# Altium schematic sheet 3轴5.2-原理图-V3.2.SchDoc
size A2
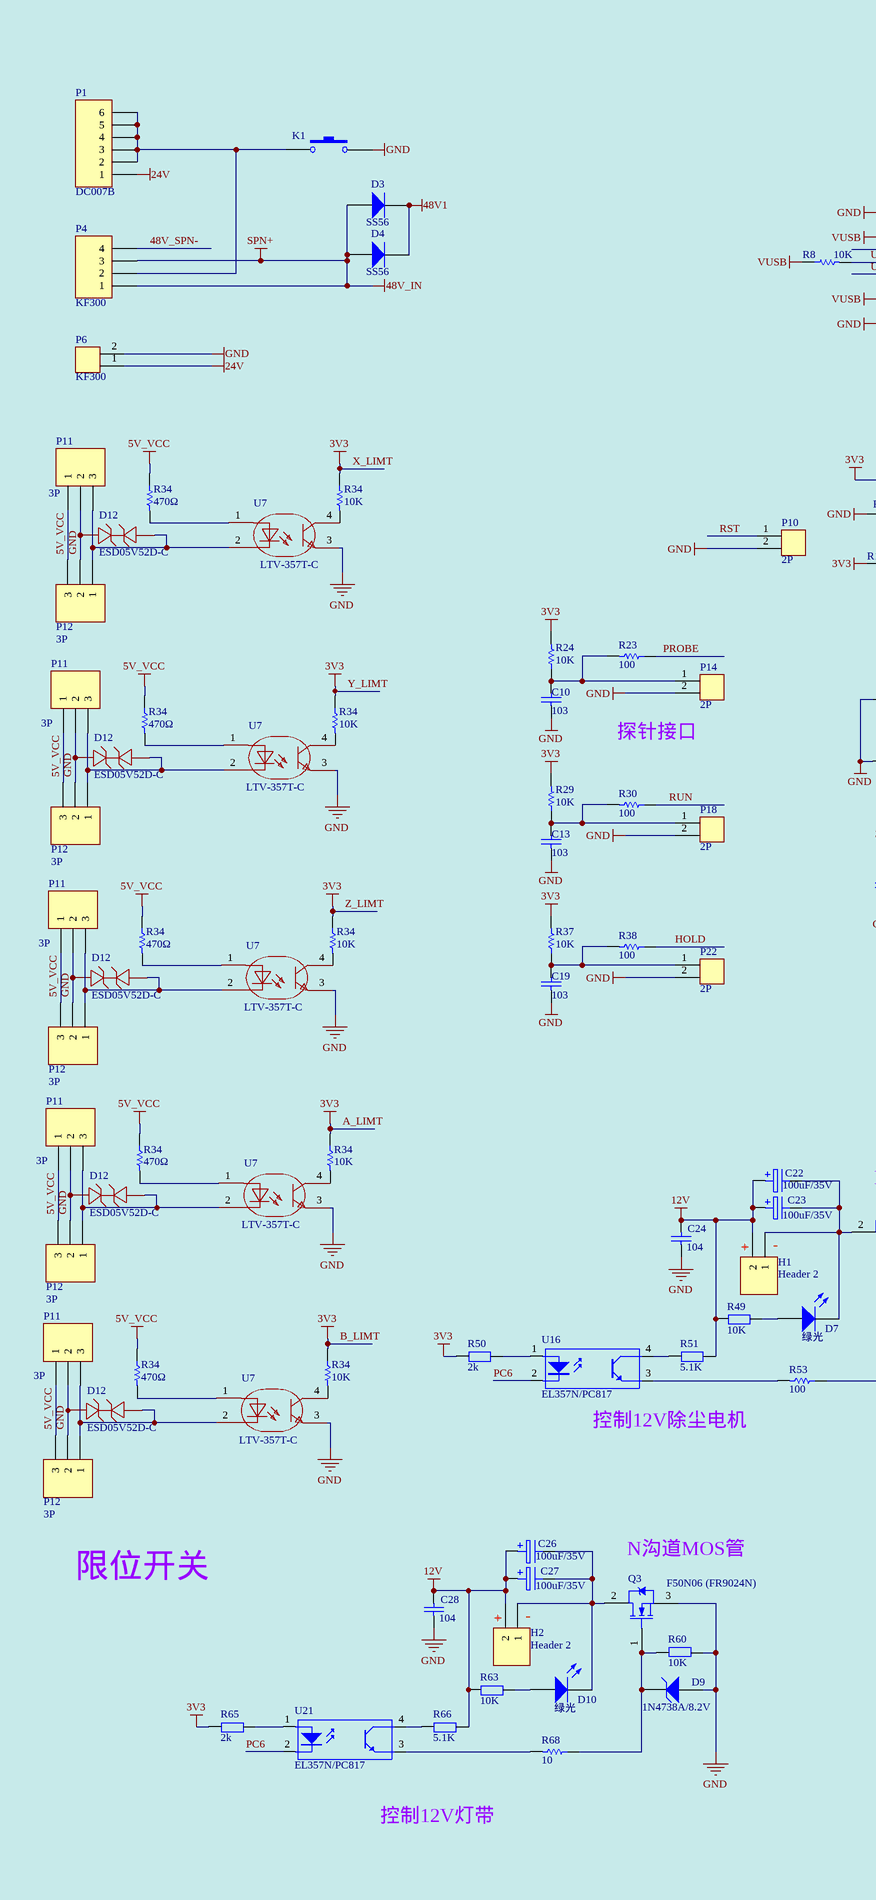
[diagram p0: 3轴5.2-原理图-V3.2.SchDoc, left]
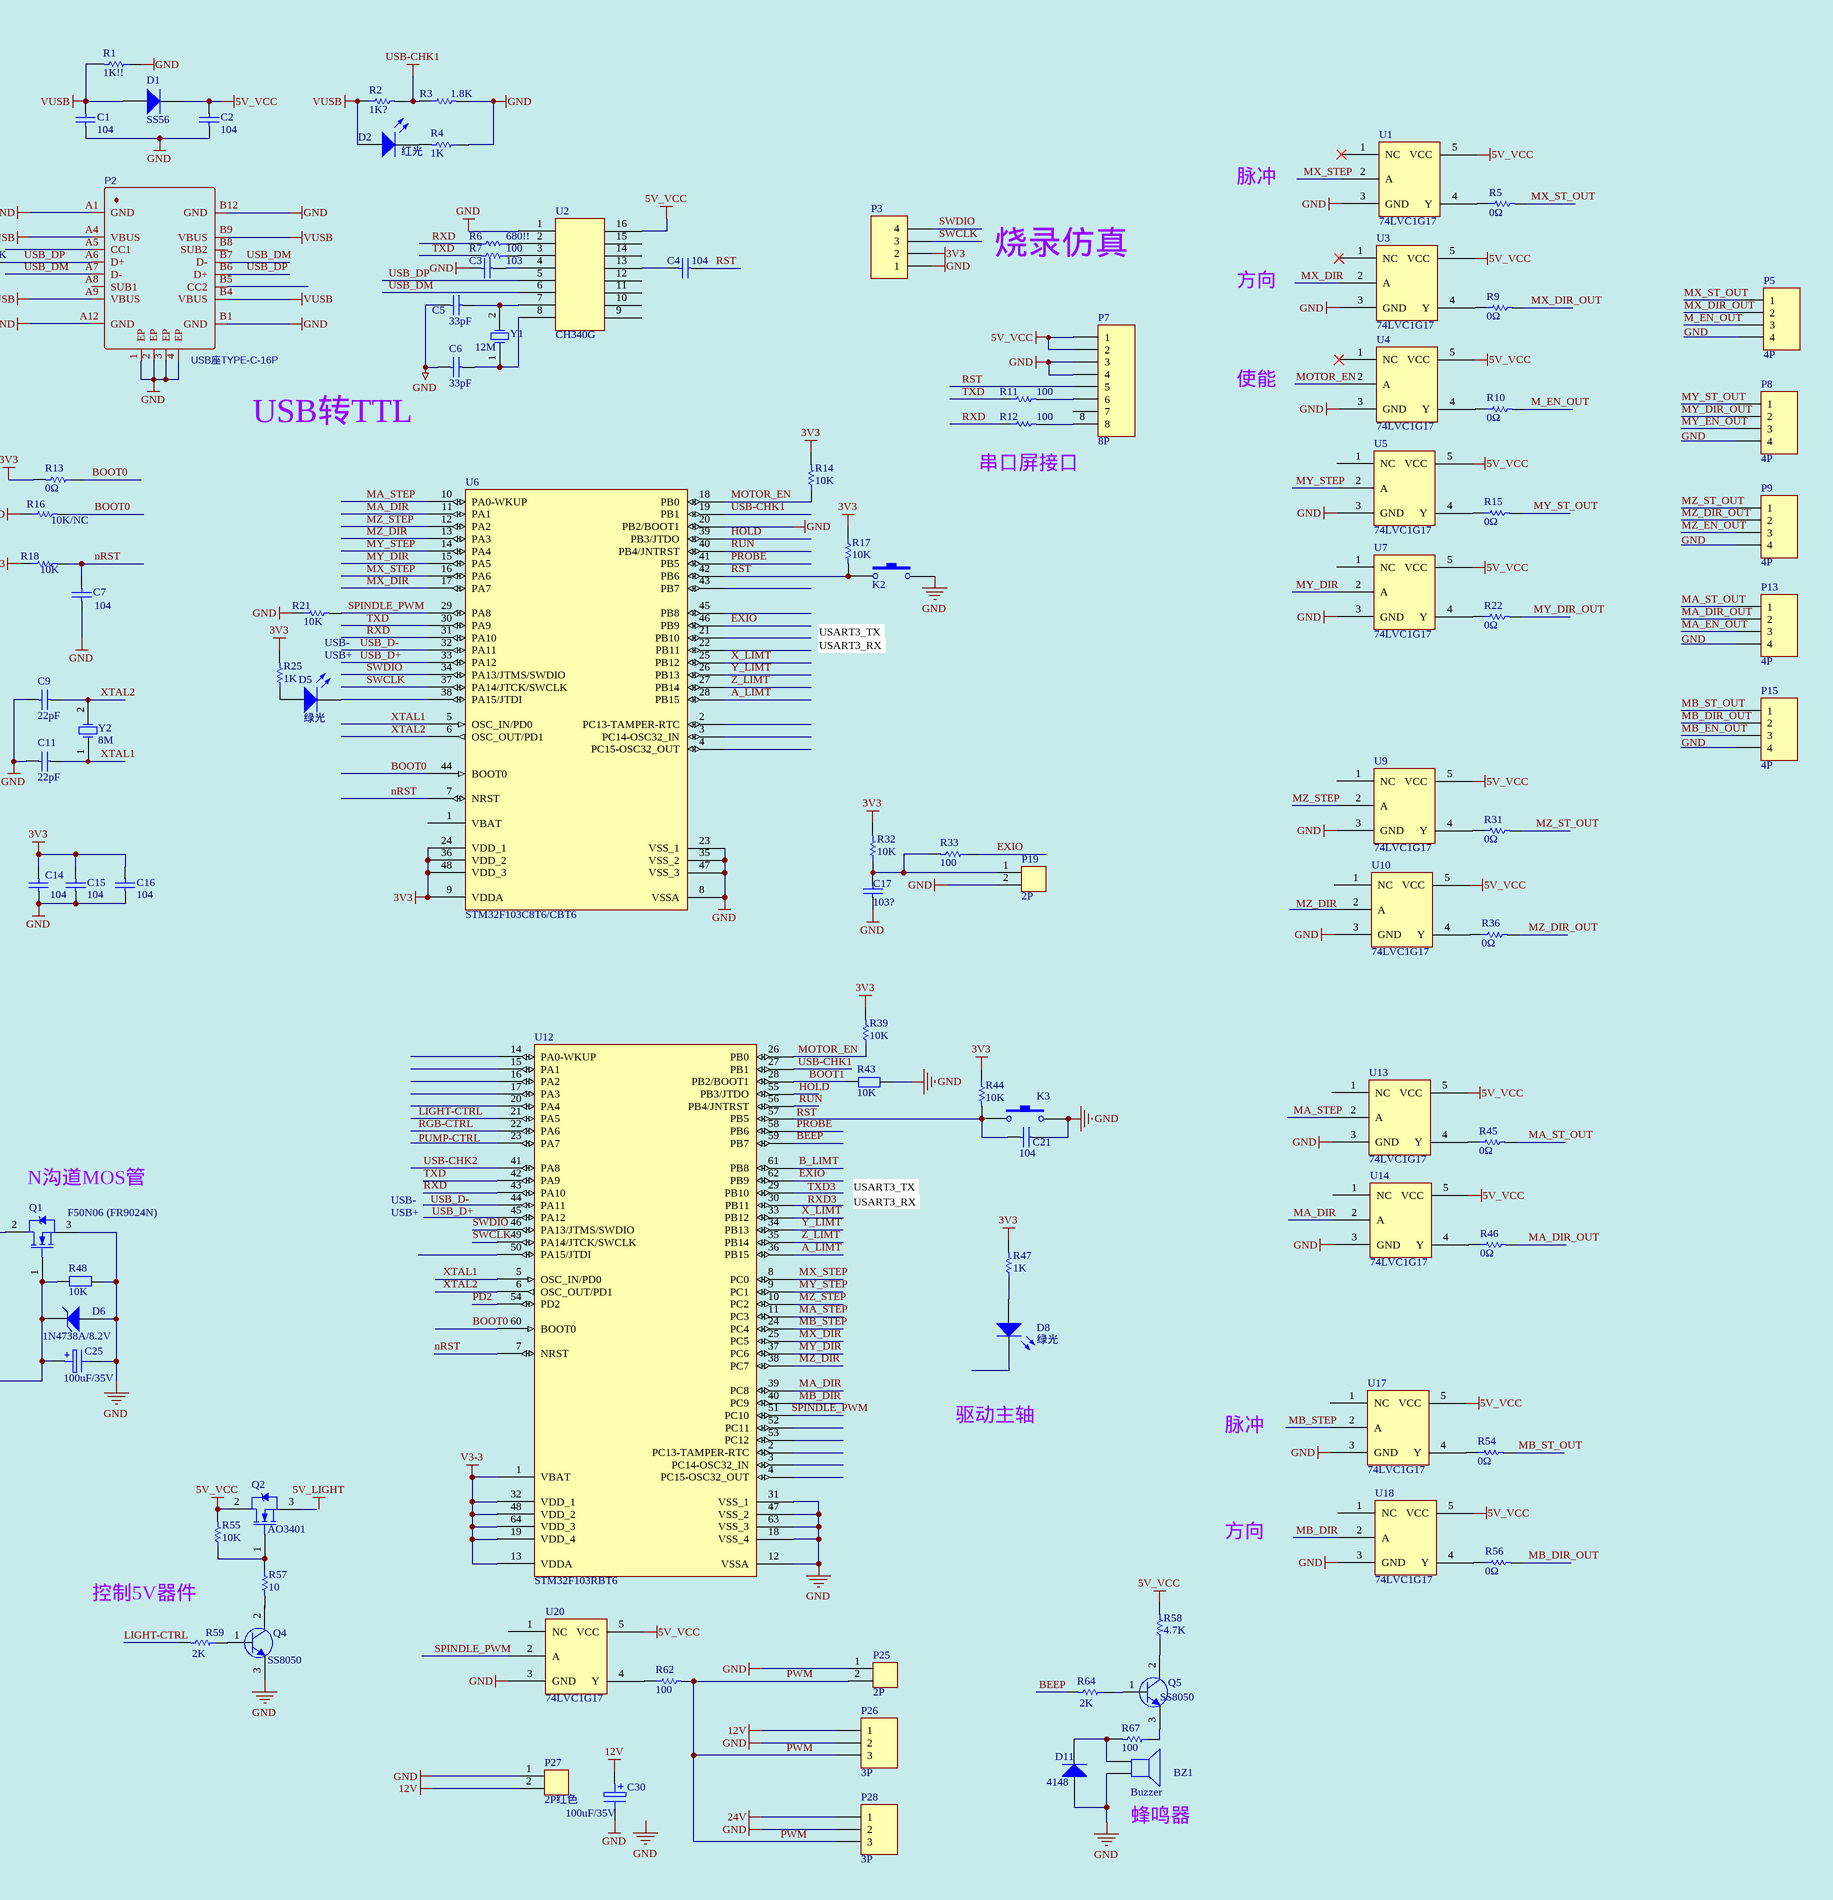
[diagram p1: 3轴5.2-原理图-V3.2.SchDoc, right]

## Parts
(Parts that share a designator on the sheet are numbered #1, #2 ... from top to bottom, then left to right.)
BZ1  Buzzer  [PIN2]
C1  104  [0603C]
C2  104  [0603C]
C3  103  [0603C]
C4  104  [0603C]
C5  33pF  [0603C]
C6  33pF  [0603C]
C7  104  [0603C]
C9  22pF  [0603C]
C10  103  [0603C]
C11  22pF  [0603C]
C13  103  [0603C]
C14  104  [0603C]
C15  104  [0603C]
C16  104  [0603C]
C17  103?  [0603C]
C19  103  [0603C]
C21  104  [0603C]
C22  100uF/35V  [电解电容贴片6x6]
C23  100uF/35V  [电解电容贴片6x6]
C24  104  [0603C]
C25  100uF/35V  [电解电容贴片6x6]
C26  100uF/35V  [电解电容贴片6x6]
C27  100uF/35V  [电解电容贴片6x6]
C28  104  [0603C]
C30  100uF/35V  [电解电容贴片6x6]
D1  SS56  [SMA]
D2  红光  [0603LED]
D3  SS56  [SMA]
D4  SS56  [SMA]
D5  绿光  [0603LED]
D6  1N4738A/8.2V  [DIODE-0.4]
D7  绿光  [0603LED]
D8  绿光  [0603LED]
D9  1N4738A/8.2V  [DIODE-0.4]
D10  绿光  [0603LED]
D11  4148  [SMA]
D12#1  ESD05V52D-C  [SOD-523_L1.2-W0.8-LS1.6-BI]
D12#2  ESD05V52D-C  [SOD-523_L1.2-W0.8-LS1.6-BI]
D12#3  ESD05V52D-C  [SOD-523_L1.2-W0.8-LS1.6-BI]
D12#4  ESD05V52D-C  [SOD-523_L1.2-W0.8-LS1.6-BI]
D12#5  ESD05V52D-C  [SOD-523_L1.2-W0.8-LS1.6-BI]
H1  Header 2  [JK128-500-2P]
H2  Header 2  [JK128-500-2P]
K1  开关按键  [船型开关KCD1-101]  (value not drawn)
K2  按键  [按键6x6贴片]  (value not drawn)
K3  按键  [按键6x6贴片]  (value not drawn)
P1  DC007B  [DC007B]
P2  USB座TYPE-C-16P  [USB-TYPE-C-16P]
P3  (no value)  [SIP4]
P4  KF300  [直插座4P-KF300]
P5  4P  [HDR1X4_CON]
P6  KF300  [直插座2P-KF300]
P7  8P  [IDC8]
P8  4P  [HDR1X4_CON]
P9  4P  [HDR1X4_CON]
P10  2P  [HDR1X2_CON]
P11#1  3P  [HDR1X3_CON]
P11#2  3P  [HDR1X3_CON]
P11#3  3P  [HDR1X3_CON]
P11#4  3P  [HDR1X3_CON]
P11#5  3P  [HDR1X3_CON]
P12#1  3P  [HDR1X3_CON]
P12#2  3P  [HDR1X3_CON]
P12#3  3P  [HDR1X3_CON]
P12#4  3P  [HDR1X3_CON]
P12#5  3P  [HDR1X3_CON]
P13  4P  [HDR1X4_CON]
P14  2P  [HDR1X2_CON]
P15  4P  [HDR1X4_CON]
P18  2P  [HDR1X2_CON]
P19  2P  [HDR1X2_CON]
P22  2P  [HDR1X2_CON]
P25  2P  [HDR1X2_CON]
P26  3P  [HDR1X3_CON]
P27  2P红色  [HDR1X2_CON]
P28  3P  [HDR1X3_CON]
Q1  F50N06 (FR9024N)  [TO-252]
Q2  AO3401  [SOT-23]
Q3  F50N06 (FR9024N)  [TO-252]
Q4  SS8050  [SOT-23]
Q5  SS8050  [SOT-23]
R1  1K!!  [0603R]
R2  1K?  [0603R]
R3  1.8K  [0603R]
R4  1K  [0603R]
R5  0Ω  [0603R]
R6  680!!  [0603R]
R7  100  [0603R]
R8  10K  [0603R]
R9  0Ω  [0603R]
R10  0Ω  [0603R]
R11  100  [0603R]
R12  100  [0603R]
R13  value 0Ω  [0603R]  (hidden comment: 10k)
R14  value 10K  [0603R]
R15  0Ω  [0603R]
R16  value 10K/NC  [0603R]  (hidden comment: 10k)
R17  10K  [0603R]
R18  10k  [0603R]
R21  10K  [0603R]
R22  0Ω  [0603R]
R23  100  [0603R]
R24  10K  [0603R]
R25  1K  [0603R]
R29  10K  [0603R]
R30  100  [0603R]
R31  0Ω  [0603R]
R32  10K  [0603R]
R33  100  [0603R]
R34#1  470Ω  [0603R]
R34#2  10K  [0603R]
R34#3  470Ω  [0603R]
R34#4  10K  [0603R]
R34#5  470Ω  [0603R]
R34#6  10K  [0603R]
R34#7  470Ω  [0603R]
R34#8  10K  [0603R]
R34#9  470Ω  [0603R]
R34#10  10K  [0603R]
R36  0Ω  [0603R]
R37  10K  [0603R]
R38  100  [0603R]
R39  value 10K  [0603R]
R43  10K  [0805R]
R44  10K  [0603R]
R45  0Ω  [0603R]
R46  0Ω  [0603R]
R47  1K  [0603R]
R48  10K  [0603R]
R49  10K  [0603R]
R50  2k  [0603R]
R51  5.1K  [0603R]
R53  100  [0603R]
R54  0Ω  [0603R]
R55  10K  [0603R]
R56  0Ω  [0603R]
R57  10  [0603R]
R58  4.7K  [0603R]
R59  2K  [0603R]
R60  10K  [0603R]
R62  100  [0603R]
R63  10K  [0603R]
R64  2K  [0603R]
R65  2k  [0603R]
R66  5.1K  [0603R]
R67  100  [0603R]
R68  10  [0603R]
U1  74LVC1G17  [SOT-23-5]
U2  CH340G  [SOP16]
U3  74LVC1G17  [SOT-23-5]
U4  74LVC1G17  [SOT-23-5]
U5  74LVC1G17  [SOT-23-5]
U6  STM32F103C8T6/CBT6  [LQFP48]
U7#1  LTV-357T-C  [SOP-4_L4.4-W3.9-P2.54-LS7.0-TL]
U7#2  74LVC1G17  [SOT-23-5]
U7#3  LTV-357T-C  [SOP-4_L4.4-W3.9-P2.54-LS7.0-TL]
U7#4  LTV-357T-C  [SOP-4_L4.4-W3.9-P2.54-LS7.0-TL]
U7#5  LTV-357T-C  [SOP-4_L4.4-W3.9-P2.54-LS7.0-TL]
U7#6  LTV-357T-C  [SOP-4_L4.4-W3.9-P2.54-LS7.0-TL]
U9  74LVC1G17  [SOT-23-5]
U10  74LVC1G17  [SOT-23-5]
U12  STM32F103RBT6  [LQFP-64]
U13  74LVC1G17  [SOT-23-5]
U14  74LVC1G17  [SOT-23-5]
U16  EL357N/PC817  [SOP-4M]
U17  74LVC1G17  [SOT-23-5]
U18  74LVC1G17  [SOT-23-5]
U20  74LVC1G17  [SOT-23-5]
U21  EL357N/PC817  [SOP-4M]
Y1  12M  [晶振贴片49SSMD]
Y2  8M  [晶振贴片]

## Nets
5V_VCC: C2.2 D1.2 P7.1 P7.2 P11#1.1 P11#2.1 P11#3.1 P11#4.1 P11#5.1 P12#1.3 P12#2.3 P12#3.3 P12#4.3 P12#5.3 Q2.2(D) R34#1.1 R34#3.1 R34#5.1 R34#7.1 R34#9.1 R55.2 U1.5(VCC) U2.16 U3.5(VCC) U4.5(VCC) U5.5(VCC) U7#2.5(VCC) U9.5(VCC) U10.5(VCC) U13.5(VCC) U14.5(VCC) U17.5(VCC) U18.5(VCC) U20.5(VCC)
12V: C22.1 C23.1 C24.2 C26.1 C27.1 C28.2 C30.1 H1.2 H2.2 P26.1 P27.2 R49.1 R51.2 R63.1 R66.2
24V: P1.1 P6.1 P28.1
48V1: D3.2 D4.2
48V_IN: D3.1 D4.1 P4.1 P4.3  [also labelled SPN+]
A_LIMT: C14.2 C15.2 C16.2 P3.2 R13.2 R14.2 R17.1 R18.1 R24.2 R25.2 R29.2 R32.2 R34#2.1 R34#4.1 R34#6.1 R34#8.1 R34#10.1 R37.2 R39.2 R44.1 R47.2 R50.1 R65.1 U6.9(VDDA) U6.24(VDD_1) U6.25(PB12) U6.26(PB13) U6.27(PB14) U6.28(PB15) U6.36(VDD_2) U6.48(VDD_3) U12.33(PB12) U12.34(PB13) U12.35(PB14) U12.36(PB15) U12.61(PB8)  [also labelled 3V3, B_LIMT, X_LIMT, Y_LIMT, Z_LIMT]
GND: BZ1.2 C1.1 C2.1 C3.2 C5.2 C6.2 C7.1 C9.2 C10.1 C11.2 C13.1 C14.1 C15.1 C16.1 C17.1 C19.1 C21.1 C24.1 C25.2 C28.1 C30.2 D6.1(A) D9.1(A) D11.1 D12#1.1 D12#2.1 D12#3.1 D12#4.1 D12#5.1 K1.2 K2.2 K3.2 P2.1(EP) P2.2(EP) P2.3(EP) P2.4(EP) P2.A1(GND) P2.A12(GND) P2.B1(GND) P2.B12(GND) P3.1 P6.2 P7.3 P7.4 P10.2 P11#1.2 P11#2.2 P11#3.2 P11#4.2 P11#5.2 P12#1.2 P12#2.2 P12#3.2 P12#4.2 P12#5.2 P14.2 P18.2 P19.2 P22.2 P25.1 P26.2 P27.1 P28.2 Q1.3(S) Q3.3(S) Q4.3(E) R1.1 R3.2 R4.1 R16.1 R21.1 R43.2 R48.1 R60.1 U1.3(GND) U2.1 U3.3(GND) U4.3(GND) U5.3(GND) U6.8(VSSA) U6.20(PB2/BOOT1) U6.23(VSS_1) U6.35(VSS_2) U6.47(VSS_3) U7#1.3 U7#2.3(GND) U7#3.3 U7#4.3 U7#5.3 U7#6.3 U9.3(GND) U10.3(GND) U12.12(VSSA) U12.18(VSS_4) U12.31(VSS_1) U12.47(VSS_2) U12.63(VSS_3) U13.3(GND) U14.3(GND) U17.3(GND) U18.3(GND) U20.3(GND)
USB-CHK1: R2.2 R3.1 U6.19(PB1) U12.27(PB1)
V3-3: U12.1(VBAT) U12.13(VDDA) U12.19(VDD_4) U12.32(VDD_1) U12.48(VDD_2) U12.64(VDD_3)
VUSB: C1.2 D1.1 D2.1 P2.A4(VBUS) P2.A9(VBUS) P2.B4(VBUS) P2.B9(VBUS) R1.2 R2.1 R8.1
48V_SPN-: P4.4
BEEP: R64.2 U12.59(PB7)
BOOT0: R13.1 R16.2 U6.44(BOOT0) U12.60(BOOT0)
BOOT1: R43.1 U12.28(PB2/BOOT1)
EXIO: R33.1 U6.46(PB9) U12.62(PB9)
HOLD: R38.1 U6.39(PB3/JTDO) U12.55(PB3/JTDO)
LIGHT-CTRL: R59.2 U12.21(PA5)
M_EN_OUT: P5.3 R10.2
MA_DIR: U6.11(PA1) U12.39(PC8) U14.2(A)
MA_DIR_OUT: P13.2 R46.2
MA_EN_OUT: P13.3
MA_ST_OUT: P13.1 R45.2
MA_STEP: U6.10(PA0-WKUP) U12.11(PC3) U13.2(A)
MB_DIR: U12.40(PC9) U18.2(A)
MB_DIR_OUT: P15.2 R56.2
MB_EN_OUT: P15.3
MB_ST_OUT: P15.1 R54.2
MB_STEP: U12.24(PC4) U17.2(A)
MOTOR_EN: R14.1 R39.1 U4.2(A) U6.18(PB0) U12.26(PB0)
MX_DIR: U3.2(A) U6.17(PA7) U12.25(PC5)
MX_DIR_OUT: P5.2 R9.2
MX_ST_OUT: P5.1 R5.2
MX_STEP: U1.2(A) U6.16(PA6) U12.8(PC0)
MY_DIR: U6.15(PA5) U7#2.2(A) U12.37(PC6)
MY_DIR_OUT: P8.2 R22.2
MY_EN_OUT: P8.3
MY_ST_OUT: P8.1 R15.2
MY_STEP: U5.2(A) U6.14(PA4) U12.9(PC1)
MZ_DIR: U6.13(PA3) U12.38(PC7)
MZ_DIR_OUT: P9.2 R36.2
MZ_EN_OUT: P9.3
MZ_ST_OUT: P9.1 R31.2
MZ_STEP: U6.12(PA2) U9.2(A) U12.10(PC2)
nRST: C7.2 R18.2 U6.7(NRST) U12.7(NRST)
PC6: U16.2(K) U21.2(K)
PD2: U12.54(PD2)
PROBE: R23.1 U6.41(PB5) U12.58(PB6)
PWM: P25.2 P26.3 P28.3 R62.2
RGB-CTRL: U12.22(PA6)
RST: C4.2 K2.1 P7.5 P10.1 R17.2 U6.42(PB6)
RUN: R30.1 U6.40(PB4/JNTRST) U12.56(PB4/JNTRST)
RXD: R6.2 R12.1 U6.31(PA10) U12.43(PA10)
SPINDLE_PWM: R21.2 U6.29(PA8) U20.2(A)
SWCLK: P3.3 U6.37(PA14/JTCK/SWCLK) U12.49(PA14/JTCK/SWCLK)
SWDIO: P3.4 U6.34(PA13/JTMS/SWDIO) U12.46(PA13/JTMS/SWDIO)
TXD: R7.2 R11.1 U6.30(PA9) U12.42(PA9)
USB-CHK2: U12.41(PA8)
USB_D+: U6.33(PA12)
USB_D-: U6.32(PA11)
USB_DM: P2.A7(D-) P2.B7(D-) U2.6
USB_DP: P2.A6(D+) P2.B6(D+) R8.2 U2.5
XTAL1: C11.1 U6.5(OSC_IN/PD0) U12.5(OSC_IN/PD0) Y2.1(OSC1)
XTAL2: C9.1 U6.6(OSC_OUT/PD1) U12.6(OSC_OUT/PD1) Y2.2(OSC2)
NetBZ1_1: BZ1.1 D11.2 R67.2
NetC3_1: C3.1 U2.4
NetC4_1: C4.1 U2.13
NetC5_1: C5.1 U2.7 Y1.2(OSC2)
NetC6_1: C6.1 U2.8 Y1.1(OSC1)
NetC10_2: C10.2 P14.1 R23.2 R24.1
NetC13_2: C13.2 P18.1 R29.1 R30.2
NetC17_2: C17.2 P19.1 R32.1 R33.2
NetC19_2: C19.2 P22.1 R37.1 R38.2
NetC21_2: C21.2 K3.1 R44.2 U12.57(PB5)
NetC22_2: C22.2 C23.2 D7.2 H1.1 Q1.2(D)
NetC25_1: C25.1 D6.2(K) Q1.1(G) R48.2 R53.1
NetC26_2: C26.2 C27.2 D10.2 H2.1 Q3.2(D)
NetD2_2: D2.2 R4.2
NetD5_1: D5.1 R25.1
NetD5_2: D5.2 U6.38(PA15/JTDI)
NetD7_1: D7.1 R49.2
NetD8_1: D8.1 R47.1
NetD9_2: D9.2(K) Q3.1(G) R60.2 R68.1
NetD10_1: D10.1 R63.2
NetD12#1_2: D12#1.2 P11#1.3 P12#1.1 U7#1.2
NetD12#2_2: D12#2.2 P11#2.3 P12#2.1 U7#3.2
NetD12#3_2: D12#3.2 P11#3.3 P12#3.1 U7#4.2
NetD12#4_2: D12#4.2 P11#4.3 P12#4.1 U7#5.2
NetD12#5_2: D12#5.2 P11#5.3 P12#5.1 U7#6.2
NetK1_1: K1.1 P1.2 P1.3 P1.4 P1.5 P1.6 P4.2
NetP7_6: P7.6 R11.2
NetP7_8: P7.8 R12.2
NetQ2_1: Q2.1(G) R55.1 R57.1
NetQ4_1: Q4.1(B) R59.1
NetQ5_1: Q5.1(B) R64.1
NetQ5_2: Q5.2(C) R58.1
NetQ5_3: Q5.3(E) R67.1
NetR5_1: R5.1 U1.4(Y)
NetR6_1: R6.1 U2.2
NetR7_1: R7.1 U2.3
NetR9_1: R9.1 U3.4(Y)
NetR10_1: R10.1 U4.4(Y)
NetR15_1: R15.1 U5.4(Y)
NetR22_1: R22.1 U7#2.4(Y)
NetR31_1: R31.1 U9.4(Y)
NetR34#1_2: R34#1.2 U7#1.1
NetR34#2_2: R34#2.2 U7#1.4
NetR34#3_2: R34#3.2 U7#3.1
NetR34#4_2: R34#4.2 U7#3.4
NetR34#5_2: R34#5.2 U7#4.1
NetR34#6_2: R34#6.2 U7#4.4
NetR34#7_2: R34#7.2 U7#5.1
NetR34#8_2: R34#8.2 U7#5.4
NetR34#9_2: R34#9.2 U7#6.1
NetR34#10_2: R34#10.2 U7#6.4
NetR36_1: R36.1 U10.4(Y)
NetR45_1: R45.1 U13.4(Y)
NetR46_1: R46.1 U14.4(Y)
NetR50_2: R50.2 U16.1(A)
NetR51_1: R51.1 U16.4(C)
NetR53_2: R53.2 U16.3(E)
NetR54_1: R54.1 U17.4(Y)
NetR56_1: R56.1 U18.4(Y)
NetR62_1: R62.1 U20.4(Y)
NetR65_2: R65.2 U21.1(A)
NetR66_1: R66.1 U21.4(C)
NetR68_2: R68.2 U21.3(E)

Not connected (* = marked no-connect by the designer): D8 2; P2 A5(CC1) A8(SUB1) B5(CC2) B8(SUB2); P5 4; P7 7; P8 4; P9 4; P13 4; P15 4; Q2 3(S); Q4 2(C); R57 2; R58 2; U1 1(NC)*; U2 9 10 11 12 14 15; U3 1(NC)*; U4 1(NC)*; U5 1(NC); U6 1(VBAT) 2(PC13-TAMPER-RTC) 3(PC14-OSC32_IN) 4(PC15-OSC32_OUT) 21(PB10) 22(PB11) 43(PB7) 45(PB8); U7#2 1(NC); U9 1(NC); U10 1(NC) 2(A); U12 2(PC13-TAMPER-RTC) 3(PC14-OSC32_IN) 4(PC15-OSC32_OUT) 14(PA0-WKUP) 15(PA1) 16(PA2) 17(PA3) 20(PA4) 23(PA7) 29(PB10) 30(PB11) 44(PA11) 45(PA12) 50(PA15/JTDI) 51(PC10) 52(PC11) 53(PC12); U13 1(NC); U14 1(NC); U17 1(NC); U18 1(NC); U20 1(NC)

## Notes on the sheet
- 脉冲
- 烧录仿真
- 方向
- 使能
- USB转TTL
- (near R12) 串口屏接口
- (near R21) USB-
- USB+
- USART3_RX
- USART3_TX
- 探针接口
- (near Q1) N沟道MOS管
- USB-
- (near H1) +
- (near H1) -
- (near U16) 控制12V除尘电机
- 驱动主轴
- 限位开关
- (near Q3) N沟道MOS管
- (near H2) +
- (near H2) -
- 控制5V器件
- 控制12V灯带
- (near BZ1) 蜂鸣器
- Labels drawn without touching a wire or pin: 5V_LIGHT, 5V_VCC, GND, MZ_DIR, PUMP-CTRL, RST, RXD3, SPINDLE_PWM, TXD3, USB_D+, USB_D-

## Library data of the parts
BZ1 = Speaker: Loudspeaker; Published: 24-Mar-1999; LatestRevisionDate: 17-Jul-2002; LatestRevisionNote: Re-released for DXP Platform.; PackageReference: PIN2; Publisher: Altium Limited
C1-C4 C7 = Cap Semi: Capacitor (Semiconductor SIM Model); Published: 8-Jun-2000; LatestRevisionDate: 17-Jul-2002; LatestRevisionNote: Re-released for DXP Platform.; PackageReference: C1206; Publisher: Altium Limited
  C1 C2 C4: Value: 104
C5 C6 = Cap Semi: Capacitor (Semiconductor SIM Model); Value: 18pF; Published: 8-Jun-2000; LatestRevisionDate: 17-Jul-2002; LatestRevisionNote: Re-released for DXP Platform.; PackageReference: C1206; Publisher: Altium Limited
C9 C11 = Cap Semi: Capacitor (Semiconductor SIM Model); Value: 100pF; Published: 8-Jun-2000; LatestRevisionDate: 17-Jul-2002; LatestRevisionNote: Re-released for DXP Platform.; PackageReference: C1206; Publisher: Altium Limited
C10 C13-C17 C19 C21 C24 C28 = CAP
  C14-C16 C21 C24 C28: value: 104
C22 C23 C25-C27 C30 = ELECTRO1
D1 D3 D4 D11 = 1N4148
D2 D5 D7 D8 D10 = LED
D6 D9 = D Zener: Zener Diode; Published: 8-Jun-2000; LatestRevisionDate: 17-Jul-2002; LatestRevisionNote: Re-released for DXP Platform.; PackageReference: DIODE-0.7; Publisher: Altium Limited; PackageDescription: Diode, Thru-Hole; 2 Leads; 0.7 in Pin Spacing
D12#1-D12#5 = ESD05V52D-C: 极性：双向 反向截止电压(Vrwm)：5V 击穿电压(VBR)：5.6V 钳位电压(Vc)@Ipp：15V 反向截止电压(Vrwm)：5V 击穿电压(最小值)：5.6V 峰值脉冲电流(Ipp)@tp=8/20μs：5A 最大钳位电压：15V; Manufacturer: TWGMC(台湾迪嘉); Add into BOM: yes; Symbol: ESD05V52D-C; Device: ESD05V52D-C; LCSC Part Name: ESD05V52D-C; Supplier Part: C727170; Manufacturer Part: ESD05V52D-C; Supplier Footprint: SOD-523; JLCPCB Part Class: 扩展库; Datasheet: https://atta.szlcsc.com/upload/public/pdf/source/20200827/C727170_700AFDE065FF081A69A0C04747B3686A.pdf; Supplier: LCSC; Convert to PCB: yes; Comment_1: ESD05V52D-C
H1 H2 = Header 2: Header, 2-Pin; LatestRevisionDate: 17-Jul-2002; LatestRevisionNote: Re-released for DXP Platform.; Publisher: Altium Limited
K1 = 按键
P1 = 6P
P2 = USB座TYPE-C-16P: BOM_Manufacturer: Shenzhen Kinghelm Elec; BOM_Manufacturer Part: KH-TYPE-C-16P-T; Contributor: LCSC; BOM_Supplier: LCSC; BOM_Supplier Part: C709358; spicePre: U; spiceSymbolName: KH-TYPE-C-16P-T
P3 P4 = 4P
P6 P27 = 2P
Q1-Q3 = NMOS-2: N-Channel Power MOSFET; Note: Pin 2 is electrically connected to pin 4.; Published: 8-Jun-2000; LatestRevisionDate: 17-Jul-2002; LatestRevisionNote: Re-released for DXP Platform.; DatasheetVersion: PD-9.814; PackageVersion: Feb-1997; PackageReference: TO-220AB; Publisher: Altium Limited; PackageDescription: TO, Thru-Hole, Vertical, Heatsink Mounted; 3 In-Line Leads; Pitch 2.54 mm; ComponentLink1Description: Manufacturer Link; ComponentLink1URL: http://www.irf.com/
Q4 Q5 = NPN: Published: 8-Jun-2000; LatestRevisionDate: 17-Jul-2002; LatestRevisionNote: Re-released for DXP Platform.; PackageReference: TO-226; Publisher: Altium Limited; Code_JEDEC: TO-226-AA
R1-R18 R21-R25 R29-R33 R34#1-R34#10 R36-R39 R44-R47 R53-R59 R62 R64 R67 R68 = RES: Resistor; Published: 8-Jun-2000; LatestRevisionDate: 17-Jul-2002; LatestRevisionNote: Re-released for DXP Platform.; PackageReference: AXIAL-0.3; Publisher: Altium Limited
  R18: Value: 10K
R43 R48-R51 R60 R63 R65 R66 = res
U2 = DIP16
U6 = STM32F103C6T6: STM32 ARM-based 32-bit MCU with 32 Kbytes Flash, 48-pin LQFP, Industrial Temperature; Published: *; DatasheetVersion: *; PackageVersion: *; PackageReference: *; Publisher: *; PackageDescription: *; ComponentLink1Description: *; ComponentLink1URL: *; ComponentLink2Description: *; ComponentLink2URL: *
U7#1 U7#3-U7#6 = LTV-357T-C: 输入电压类型:DC;正向电压:1.2V;输出电流:50mA;隔离电压(rms):3.75kV;反向电压:6V;接收端电压:35V;输出通道数:1;集射极饱和电压(Vce(sat)@Ic,IF):200mV@1mA,20mA;; Manufacturer: LITEON(光宝); Symbol: LTV-357T-C_C119091; Add into BOM: yes; Input voltage type: DC; Output Type: 光电三极管; Forward Voltage: 1.2V; Output Current: 50mA; Isolation Voltage(rms): 3.75kV; Reverse Voltage: 6V; Receiving End Voltage: 35V; Number of Outputs: 1; Rise time: 4us@2mA,100Ω; Fall time: 3us@2mA,100Ω; Device: LTV-357T-C; Supplier: LCSC; Manufacturer Part: LTV-357T-C; Supplier Part: C119091; JLCPCB Part Class: 扩展库; LCSC Part Name: DC输入隔离电压(rms):3750V; Supplier Footprint: SOP-4-2.54mm; Datasheet: https://atta.szlcsc.com/upload/public/pdf/source/20170930/C133128_1506736380934997376.pdf; Convert to PCB: yes; Collector-Emitter Saturation Voltage (Vce(sat)@Ic,IF): 200mV@1mA,20mA; Operating Temperature: -55℃~+110℃; Comment_1: LTV-357T-C
U12 = STM32F103RBT6: STM32 ARM-based 32-bit MCU with 128 Kbytes Flash, 64-pin LQFP, Industrial Temperature; Published: 30-May-2008; DatasheetVersion: rev6, Mar-2008; PackageVersion: Mar-2008; PackageReference: LQFP64; Publisher: Altium Limited; PackageDescription: 64-Pin Low-Profile Quad Flat Pack, 10 x 10 mm Body, 0.5 mm Pitch (LQFP64); ComponentLink1Description: Manufacturer Link; ComponentLink1URL: www.st.com/stm32; ComponentLink2Description: Datasheet; ComponentLink2URL: http://www.st.com/stonline/products/literature/ds/13587.pdf
U16 U21 = Optoisolator1: 4-Pin Phototransistor Optocoupler; Published: 24-Mar-1999; LatestRevisionDate: 04-Mar-2005; LatestRevisionNote: Sch pins 3 & 4 Swapped.; DatasheetVersion: Nov-2003; PackageReference: DIP-4; Publisher: Altium Limited
Y1 Y2 = XTAL: Crystal Oscillator; Published: 8-Jun-2000; LatestRevisionDate: 17-Jul-2002; LatestRevisionNote: Re-released for DXP Platform.; PackageReference: R38; Publisher: Altium Limited